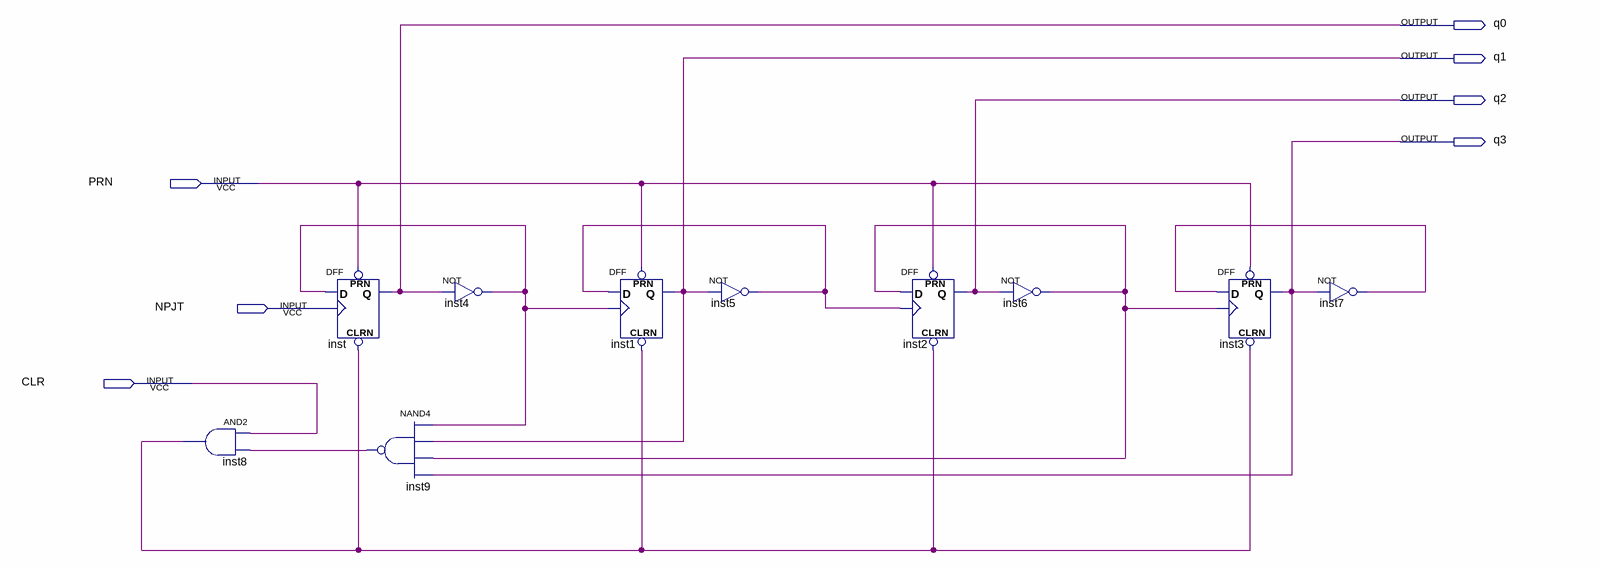
[diagram p0: schematic sheet]
// Quartus schematic jishu.bdf as structural Verilog: 10 symbols, 7 pins
module jishu (
  input  PRN,
  input  NPJT,
  input  CLR,
  output q0,
  output q1,
  output q2,
  output q3
);

  wire inst4_out, inst5_out, inst6_out, inst7_out, inst8_out, inst9_out;

  and inst8 (inst8_out, CLR, inst9_out);
  DFF inst (.CLRN(inst8_out), .CLK(NPJT), .D(inst4_out), .PRN(PRN), .Q(q0));
  nand inst9 (inst9_out, inst4_out, q1, inst6_out, q3);
  not inst4 (inst4_out, q0);
  DFF inst1 (.CLRN(inst8_out), .CLK(inst4_out), .D(inst5_out), .PRN(PRN), .Q(q1));
  not inst5 (inst5_out, q1);
  DFF inst2 (.CLRN(inst8_out), .CLK(inst5_out), .D(inst6_out), .PRN(PRN), .Q(q2));
  not inst6 (inst6_out, q2);
  DFF inst3 (.CLRN(inst8_out), .CLK(inst6_out), .D(inst7_out), .PRN(PRN), .Q(q3));
  not inst7 (inst7_out, q3);
endmodule
